# Altium schematic sheet SRF(1).SchDoc
size A4
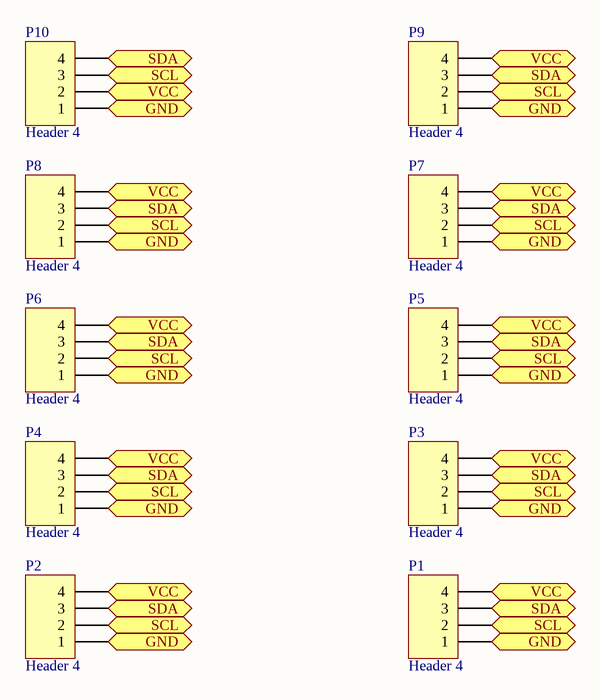
[diagram p0: SRF(1).SchDoc]

## Parts
P1  Header 4  [HDR1X4]
P2  Header 4  [HDR1X4]
P3  Header 4  [HDR1X4]
P4  Header 4  [HDR1X4]
P5  Header 4  [HDR1X4]
P6  Header 4  [HDR1X4]
P7  Header 4  [HDR1X4]
P8  Header 4  [HDR1X4]
P9  Header 4  [HDR1X4]
P10  Header 4  [HDR1X4]

## Ports
GND, SCL, SDA, VCC

## Nets
GND: P1.1 P2.1 P3.1 P4.1 P5.1 P6.1 P7.1 P8.1 P9.1 P10.1 ; port GND
SCL: P1.2 P2.2 P3.2 P4.2 P5.2 P6.2 P7.2 P8.2 P9.2 P10.3 ; port SCL
SDA: P1.3 P2.3 P3.3 P4.3 P5.3 P6.3 P7.3 P8.3 P9.3 P10.4 ; port SDA
VCC: P1.4 P2.4 P3.4 P4.4 P5.4 P6.4 P7.4 P8.4 P9.4 P10.2 ; port VCC

## Library data of the parts
P1-P10 = Header 4: Header, 4-Pin; LatestRevisionDate: 17-Jul-2002; LatestRevisionNote: Re-released for DXP Platform.; Publisher: Altium Limited